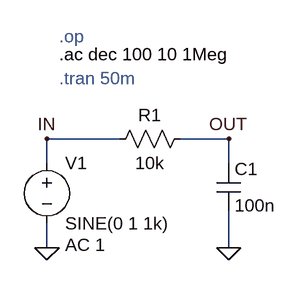
[diagram p0: schematic RC-low-pass.asc]
RC-low-pass.asc, the LTspice schematic file:
Version 4.1
SHEET 1 880 680
WIRE 144 80 48 80
WIRE 288 80 224 80
WIRE 48 112 48 80
WIRE 288 112 288 80
WIRE 48 224 48 192
WIRE 288 224 288 176
FLAG 48 224 0
FLAG 288 224 0
FLAG 48 80 IN
FLAG 288 80 OUT
SYMBOL voltage 48 96 R0
WINDOW 123 24 124 Left 2
WINDOW 39 0 0 Left 0
SYMATTR Value2 AC 1
SYMATTR InstName V1
SYMATTR Value SINE(0 1 1k)
SYMBOL res 240 64 R90
WINDOW 0 0 56 VBottom 2
WINDOW 3 32 56 VTop 2
SYMATTR InstName R1
SYMATTR Value 10k
SYMBOL cap 272 112 R0
SYMATTR InstName C1
SYMATTR Value 100n
TEXT 64 0 Left 2 ;.tran 50m
TEXT 64 -32 Left 2 !.ac dec 100 10 1Meg
TEXT 64 -56 Left 2 ;.op

The netlist it stands for:
* RC-low-pass.asc
V1 IN 0 SINE(0 1 1k) AC 1
R1 OUT IN 10k
C1 OUT 0 100n
* .tran 50m
.ac dec 100 10 1Meg
* .op
.backanno
.end